# Altium schematic sheet Regulators.SchDoc
size Letter; CompanyName: PloopyCo; Organization: Ploopy Co; Address1: 137-1140 Burnhamthorpe Road W; Address2: Mississauga; Address3: Ontario; Address4: Canada L5C 0A3; DocumentNumber: 6; Revision: R1.004; SheetNumber: 6; SheetTotal: 8
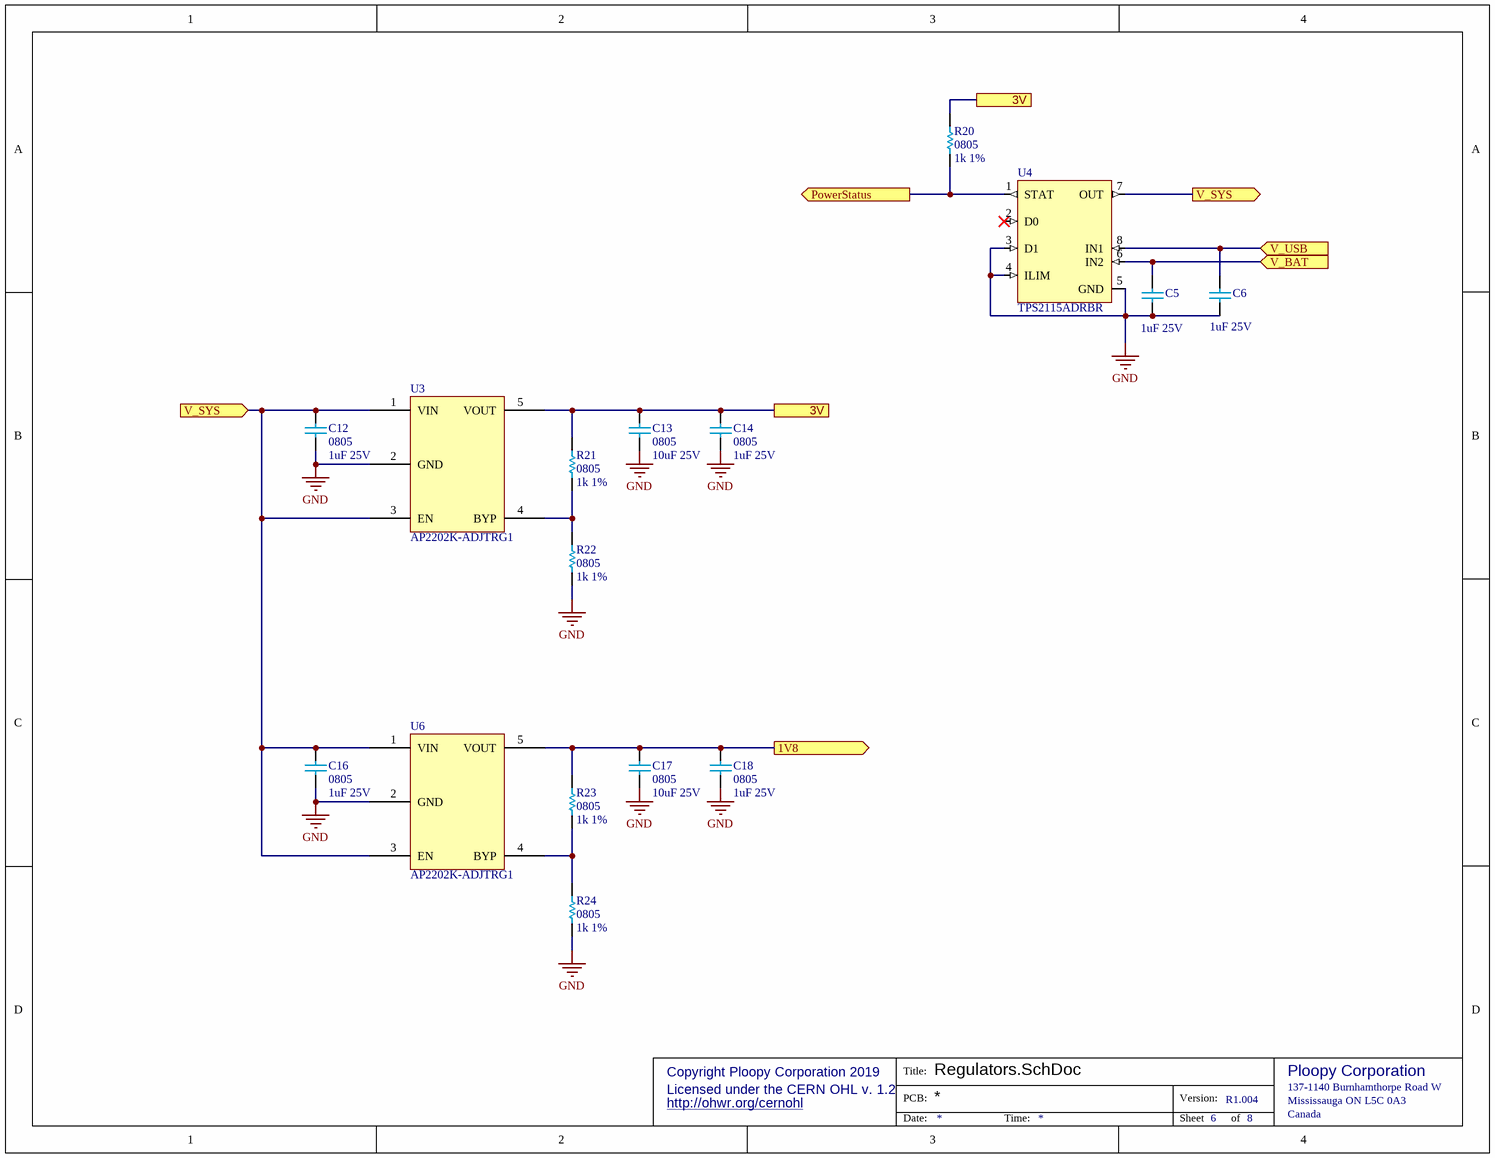
[diagram p0: Regulators.SchDoc]

## Parts
C5  value 1uF 25V  [C0603]  (hidden comment: 0805)
C6  value 1uF 25V  [C0603]  (hidden comment: 0805)
C12  0805  value 1uF 25V  [C0603]
C13  0805  value 10uF 25V  [C0603]
C14  0805  value 1uF 25V  [C0603]
C16  0805  value 1uF 25V  [C0603]
C17  0805  value 10uF 25V  [C0603]
C18  0805  value 1uF 25V  [C0603]
R20  0805  value 1k 1%  [0603]
R21  0805  value 1k 1%  [0603]
R22  0805  value 1k 1%  [0603]
R23  0805  value 1k 1%  [0603]
R24  0805  value 1k 1%  [0603]
U3  AP2202K-ADJTRG1  [AP2202 - SOT95P270X145-5N]
U4  TPS2115ADRBR  [TSSOP-8]
U6  AP2202K-ADJTRG1  [AP2202 - SOT95P270X145-5N]

## Ports
1V8 (out), 3V, PowerStatus (out), V_BAT (in), V_SYS (in), V_SYS (out), V_USB (in)

## Nets
GND: C5.1 C6.1 C12.1 C13.1 C14.1 C16.1 C17.1 C18.1 R22.1 R24.1 U3.2(GND) U4.3(D1) U4.4(ILIM) U4.5(GND) U6.2(GND)
1V8: C17.2 C18.2 R23.2 U6.5(VOUT) ; port 1V8
3V: C13.2 C14.2 R20.2 R21.2 U3.5(VOUT) ; port 3V
PowerStatus: R20.1 U4.1(STAT) ; port PowerStatus
V_BAT: C5.2 U4.6(IN2) ; port V_BAT
V_SYS: C12.2 C16.2 U3.1(VIN) U3.3(EN) U4.7(OUT) U6.1(VIN) U6.3(EN) ; port V_SYS
V_USB: C6.2 U4.8(IN1) ; port V_USB
NetR21_1: R21.1 R22.2 U3.4(BYP)
NetR23_1: R23.1 R24.2 U6.4(BYP)

Not connected (* = marked no-connect by the designer): U4 2(D0)*

## Notes on the sheet
- Copyright Ploopy Corporation 2019
- Licensed under the CERN OHL v. 1.2
- http://ohwr.org/cernohl
- Title:
- PCB:
- Version:
- Ploopy Corporation
- Mississauga ON L5C 0A3
- 137-1140 Burnhamthorpe Road W
- Date:
- Time:
- Sheet
- of
- Canada

## Library data of the parts
C5 C6 C12 C14 C16 C18 = Cap 1uF 25V: 0805, X5R or better; PNP-Nzl: 2; PNP-dx: 0; PNP-Level: 1; PNP-Thk: 1.25; PNP-TS: 70; PNP-Type: chi; PNP-X: 2.00; PNP-FeedType: Tape; PNP-TapeWidth: 8; Supplier 1: Digi-Key; Supplier Part Number 1: 1276-1066-2-ND; Supplier 2: Digi-Key; Supplier Part Number 2: 1276-1066-1-ND; PNP-dy: 0; PNP-Lv: 1; PNP-Pt: 0; PNP-Voff: 0; PNP-W: 0; PNP-Y: 1.25; PNP-A: 0; PNP-PlacePriority: 1; PNP-TapeIndex: 1; PNP-da: 0
C13 C17 = Cap 10uF 25V: 0805, X5R or better; PNP-Nzl: 2; PNP-dx: 0; PNP-X: 2.00; PNP-Y: 1.25; PNP-Lv: 1; PNP-TS: 70; PNP-Type: chi; PNP-FeedType: Tape; PNP-TapeWidth: 8; PNP-dy: 0; PNP-Pt: 0; PNP-W: 0; PNP-Thk: 1.25; PNP-Level: 1; PNP-Voff: 0; PNP-PlacePriority: 1; PNP-A: 0; PNP-TapeIndex: 1; Supplier 1: Mouser; Supplier Part Number 1: 81-GRM21BR61E106KA3L; Supplier 2: Digi-Key; Supplier Part Number 2: 490-5523-1-ND; PNP-da: 0
R20-R24 = Res 1k 1% 0805: Chip resistor, 1/8W 100PPM; PNP-Nzl: 2; PNP-dx: 0; PNP-X: 2.00; PNP-Y: 1.25; PNP-Thk: 0.55; PNP-Lv: 1; PNP-TS: 70; PNP-Type: chi; PNP-FeedType: Tape; PNP-TapeWidth: 8; Supplier 1: Digi-Key; Supplier Part Number 1: RMCF0805FT1K00TR-ND; PNP-dy: 0; PNP-Pt: 0; PNP-W: 0; PNP-Level: 1; PNP-Voff: 0; PNP-PlacePriority: 1; PNP-A: 0; PNP-TapeIndex: 1; PNP-da: 0
U3 U6 = AP2202K-3.3: 3.3V 150mA LDO regulator; PNP-Nzl: 2; PNP-dx: 0; PNP-X: 2.9; PNP-Y: 1.3; PNP-A: 90; PNP-Thk: 1; PNP-Lv: 26; PNP-Type: CHP; PNP-FeedType: Tape; PNP-TapeWidth: 8; PNP-PlacePriority: 3; PNP-dy: 0; PNP-Pt: 0; PNP-W: 0; PNP-TS: 90; PNP-Level: 1; PNP-Voff: 0; PNP-TapeIndex: 1; Supplier 1: Mouser; Supplier Part Number 1: 621-AP2202K-3.3TRG1; Supplier 2: Digi-Key; Supplier Part Number 2: AP2202K-3.3TRG1DICT-ND; Supplier 3: Arrow; Supplier Part Number 3: PWagzdsTFFHKE_U17B45SP-NtndBrheJIaI5hB7gHD0ZVywxIBNyoAQstvnyfZZ0; PNP-da: 0